# Altium schematic sheet Archived.SchDoc
size A4; SheetNumber: 4; SheetTotal: 4
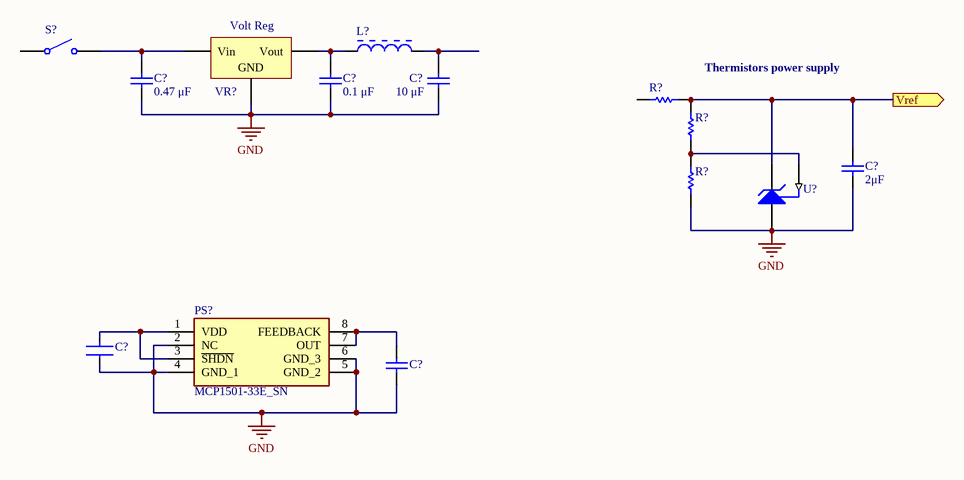
[diagram p0: Archived.SchDoc]

## Parts
(Parts that share a designator on the sheet are numbered #1, #2 ... from top to bottom, then left to right.)
C?#1  value 0.47 μF  (hidden comment: Capacitor)
C?#2  value 0.1 μF  (hidden comment: Capacitor)
C?#3  value 10 μF  (hidden comment: Capacitor)
C?#4  value 2μF  (hidden comment: Capacitor)
C?#5  CL10A225KO8NNNC  [FP-CL10-IPC_A]  (value not drawn)
C?#6  VJ0402Y102JXXCW1BC  [CAPC1005X55X25NL05T05]  (value not drawn)
L?  BL01RN1A1D2B  [INDA65-500X360]  (value not drawn)
PS?  MCP1501-33E_SN  [SOIC127P600X175-8N]
R?#1  Resistor  (value not drawn)
R?#2  Resistor  (value not drawn)
R?#3  Resistor  (value not drawn)
S?  Single-Pole, Single-Throw Switch  (value not drawn)
U?  TL431AILPR  [LP0003A]  (value not drawn)
VR?  Volt Reg  [D2PAK_N]

## Ports
Vref (out, see Power Supply Unit[4B], Thermistors[1B])

## Nets
GND: C?#1.1 C?#2.1 C?#3.1 C?#4.1 C?#5.2 C?#6.1 PS?.2(NC) PS?.4(GND_1) PS?.5(GND_2) PS?.6(GND_3) R?#3.1 U?.2(ANODE) VR?.2(GND)
Vref: C?#4.2 R?#1.1 R?#2.2 U?.3(CATHODE) ; port Vref
NetC?#1_2: C?#1.2 S?.2 VR?.1(Vin)
NetC?#2_2: C?#2.2 L?.1 VR?.3(Vout)
NetC?#3_2: C?#3.2 L?.2
NetC?#5_1: C?#5.1 PS?.1(VDD) PS?.3(~{SHDN})
NetC?#6_2: C?#6.2 PS?.7(OUT) PS?.8(FEEDBACK)
NetR?#2_1: R?#2.1 R?#3.2 U?.1(REF)

Not connected (* = marked no-connect by the designer): R?#1 2; S? 1

## Notes on the sheet
- (near R?#1) Thermistors power supply

## Library data of the parts
C?#1-C?#4 = Capacitor: SimulationGenericComponent: True
C?#5 = CMP-13271-000835-1: Cap Ceramic 2.2uF 16V X5R ±10% Pad SMD 0603 +85°C T/R; Case Code (Metric): 1608; Height: 0.8mm; Case/Package: 0603; Depth: 0.8mm; Capacitance: 2.2uF; Voltage Rating: 16V; Case Code (Imperial): 0603; Length: 1.6mm; Packaging: Tape and Reel; Material: Ceramic; Lead Free: Lead Free; Max Operating Temperature: 85°C; Contact Plating: Tin; Thickness: 0.035inch; Radiation Hardening: No; Tolerance: 10%; Min Operating Temperature: -55°C; Voltage: 16V; Dielectric: X5R; Mount: Surface Mount; Package Quantity: 4000; Width: 0.031inch; Voltage Rating (DC): 16V
C?#6 = CMP-2008-01349-1: Manufacturer: Vitramon; Part Number: VJ0402Y102JXXCW1BC
L? = CMP-006-00003-3: EMI Suppression Filter (Lead Type EMIFIL(R)), 7 A, -40 to 85 degC, 2-Pin THD, RoHS, Bulk; Manufacturer: Murata; Impedance: 50Ohm; Current Rating: 7A; Core Material: Ferrite; Packaging: Bulk; Package Reference: INDA65-500X360; Case/Package: Axial; Datasheet URL: http://www.murata.com/en-us/products/productdata/8796738977822/ENFA0005.pdf; Package Quantity: 500; Diameter: 3.6mm; Datasheet Version: May-16; Min Operating Temperature: -40°C; Mounting Technology: TH; RoHS Compliant: True; Package Description: 2-Pin Axial Lead, Dia 3.6 mm, Body Length 5 mm; Max Operating Temperature: 85°C; Pins: 2; Max Current Rating: 7A
PS? = MCP1501-33E_SN: Power Supply; Manufacturer_Name: Microchip; Manufacturer_Part_Number: MCP1501-33E/SN; Datasheet Link: http://www.farnell.com/datasheets/2158574.pdf; Height: 1.75mm; Mouser Part Number: 579-MCP1501-33E/SN; Mouser Price/Stock: https://www.mouser.co.uk/ProductDetail/Microchip-Technology-Atmel/MCP1501-33E-SN?qs=BA62vJVifGoOZffNI8tq9A%3D%3D; Arrow Part Number: MCP1501-33E/SN; Arrow Price/Stock: https://www.arrow.com/en/products/mcp1501-33esn/microchip-technology?region=nac
R?#1-R?#3 = Resistor: TC1: 0; SimulationGenericComponent: True; Value: 1K; TC2: 0
S? = SPST SW: closed: 0; Rclosed: 1m; Ropen: 1Meg; SimulationGenericComponent: True
U? = CMP-019-00054-1: IC VREF SHUNT ADJ TO92-3; Max Output Voltage: 36V; Cathode Current: 700uA; Max Output current: 100mA; Min Input Voltage: 2.495V; Temperature Coefficient: 92ppm/°C; Max Supply Voltage: 37V; Reference Type: Shunt,Adjustable; Tolerance: 1%; Number of Channels: 1; Max Operating Temperature: 125°C; Reach SVHC Compliant: Yes; Weight: 0.00752oz; Case/Package: TO-92-3; RoHS Compliant: Yes; Packaging: Tape and Reel; Lead Free: Lead Free; Package Quantity: 1; Output Voltage: 36V; Output Current: 100mA; Series: -; Reference Voltage: 36V; Min Operating Temperature: -40°C; Pins: 3
VR? = Volt Reg: Voltage Regulator; Published: 24-Mar-1999; LatestRevisionDate: 29-May-2009; LatestRevisionNote: IPC-7351 Footprint Added.; PackageReference: D2PAK; Publisher: Altium Limited; PackageDescription: 3-Pin Transistor Outline Package 2.54 mm Pitch, 15.1 mm Lead Span